# Altium schematic sheet manip-cam-mod-schematic.SchDoc: Manipulator & Camera Module
size A3; Author: Sander Furre; CompanyName: VORTEX NTNU; SheetNumber: 1; ProjectName: Manipulator-Camera-Module
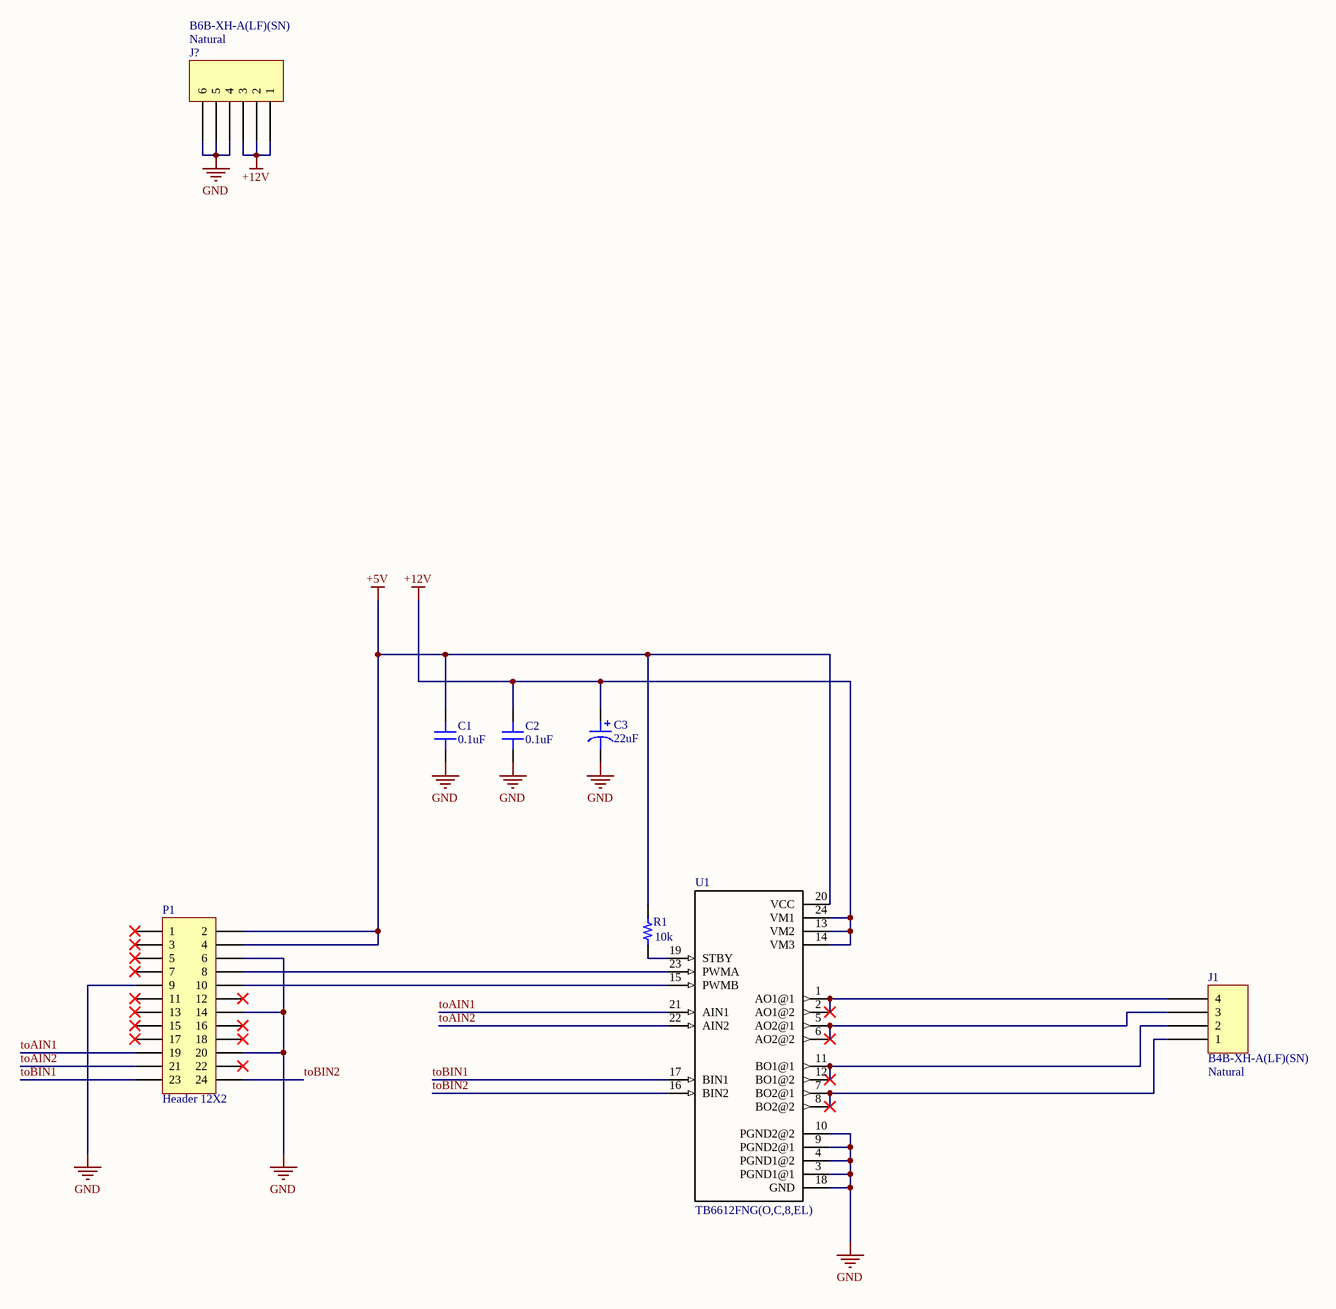
[diagram p0: manip-cam-mod-schematic.SchDoc]

## Parts
C1  0.1uF  [RES 0805/2012]
C2  0.1uF  [RES 0805/2012]
C3  22uF  [CAP ALUM 6.6MM]
J1  B4B-XH-A(LF)(SN)  Colour: Natural  [JST XH B4B-XH-A]
J?  B6B-XH-A(LF)(SN)  Colour: Natural  [JST XH B6B-XH-A]
P1  Header 12X2  [HDR2X12]
R1  10k  [RES 0805/2012]
U1  TB6612FNG(O,C,8,EL)  [SOP65P760X160-24N]

## Nets
+5V: C1.2 P1.2 P1.4 R1.2 U1.20(VCC)
+12V: C2.2 C3.1 J?.1 J?.2 J?.3 U1.13(VM2) U1.14(VM3) U1.24(VM1)
GND: C1.1 C2.1 C3.2 J?.4 J?.5 J?.6 P1.6 P1.9 P1.14 P1.20 U1.3(PGND1@1) U1.4(PGND1@2) U1.9(PGND2@1) U1.10(PGND2@2) U1.18(GND)
toAIN1: P1.19 U1.21(AIN1)
toAIN2: P1.21 U1.22(AIN2)
toBIN1: P1.23 U1.17(BIN1)
toBIN2: P1.24 U1.16(BIN2)
NetJ1_1: J1.1 U1.7(BO2@1) U1.8(BO2@2)
NetJ1_2: J1.2 U1.11(BO1@1) U1.12(BO1@2)
NetJ1_3: J1.3 U1.5(AO2@1) U1.6(AO2@2)
NetJ1_4: J1.4 U1.1(AO1@1) U1.2(AO1@2)
NetP1_8: P1.8 U1.23(PWMA)
NetP1_10: P1.10 U1.15(PWMB)
NetR1_1: R1.1 U1.19(STBY)

Not connected (* = marked no-connect by the designer): P1 1* 3* 5* 7* 11* 12* 13* 15* 16* 17* 18* 22*

## Notes on the sheet
- Title
- Size
- Author
- Rev
- A3
- Sheet no.
- of

## Library data of the parts
C1 C2 = C2012X7R1H104K085AA: CAP CER 0.1UF 50V X7R 0805; Manufacturer: TDK Corporation; TemperatureRange: -55C ~ 125C; Tolerance: 10%; Value: 0.1uF; Part Number: C2012X7R1H104K085AA; PartId: 4390; Supplier 1: Digi-Key; Supplier Part Number 1: 445-7534-2-ND; ComponentLink1Description: Datasheet; ComponentLink1URL: https://product.tdk.com/info/en/catalog/datasheets/mlcc_commercial_general_en.pdf; ComponentLink2Description: Digi-Key listing; ComponentLink2URL: http://digikey.com/product-detail/en/C2012X7R1H104K085AA/445-7534-2-ND/2732969; TemperatureCoefficient: X7R; Voltage: 50V; Price: 0,0182; Type: -; Device Package: 0805 (2012 Metric)
C3 = EEE-1EA220AP: CAP ALUM 22UF 20% 25V SMD; Manufacturer: Panasonic Electronic Components; TemperatureRange: -40C ~ 85C; Type: High Temperature Reflow; Ripple Current: 55mA; Lifetime @ Temp: 2000 Hrs @ 85C; Value: 22uF; Part Number: EEE-1EA220AP; PartId: 7220; Supplier 1: Digi-Key; Supplier Part Number 1: PCE4596TR-ND; ComponentLink1Description: Datasheet; ComponentLink1URL: http://media.digikey.com/pdf/Data%20Sheets/Panasonic%20Electronic%20Components/S_Series_Type_V.pdf; ComponentLink2Description: Digi-Key listing; ComponentLink2URL: http://digikey.com/product-detail/en/EEE-1EA220AP/PCE4596TR-ND/1717762; Tolerance: 20%; Voltage: 25V; Price: 0,1368; Device Package: Radial, Can - SMD; Impedance: -
J1 = B4B-XH-A(LF)(SN): CONN HEADER XH TOP 4POS 2.5MM; Manufacturer: JST Sales America Inc.; Pitch: 0.098" (2.50mm); Number Of Positions: 4; Part Number: B4B-XH-A(LF)(SN); PartId: 16451; Supplier 1: Digi-Key; Supplier Part Number 1: 455-2249-ND; ComponentLink1Description: Datasheet; ComponentLink1URL: http://www.jst-mfg.com/product/pdf/eng/eXH.pdf; ComponentLink2Description: Digi-Key Listing; ComponentLink2URL: http://www.digikey.com/product-detail/en/jst-sales-america-inc/B4B-XH-A(LF)(SN)/455-2249-ND/1651047; Price: 0,21; Type: Header, Shrouded; Contact Finish: Tin; Fastening Type: Detent Lock; Number Of Rows: 1; Series: XH
J? = B6B-XH-A(LF)(SN): CONN HEADER XH TOP 6POS 2.5MM; Manufacturer: JST Sales America Inc.; Pitch: 0.098" (2.50mm); Number Of Positions: 6; Part Number: B6B-XH-A(LF)(SN); PartId: 16453; Supplier 1: Digi-Key; Supplier Part Number 1: 455-2271-ND; ComponentLink1Description: Datasheet; ComponentLink1URL: http://www.jst-mfg.com/product/pdf/eng/eXH.pdf; ComponentLink2Description: Digi-Key Listing; ComponentLink2URL: http://www.digikey.com/product-detail/en/jst-sales-america-inc/B6B-XH-A(LF)(SN)/455-2271-ND/1000381; Price: 0,27; Type: Header, Shrouded; Contact Finish: Tin; Fastening Type: Detent Lock; Number Of Rows: 1; Series: XH
P1 = Header 12X2: Header, 12-Pin, Dual row; LatestRevisionDate: 17-Jul-2002; LatestRevisionNote: Re-released for DXP Platform.; Publisher: Altium Limited
R1 = ERA-6AEB103V: RES SMD 10K OHM 0.1% 1/8W 0805; Manufacturer: Panasonic Electronic Components; TemperatureRange: -55C ~ 155C; TemperatureCoefficient: 25ppm/C; PowerRating: 0.125W, 1/8W; Value: 10k; Part Number: ERA-6AEB103V; PartId: 2446; Supplier 1: Digi-Key; Supplier Part Number 1: P10KDATR-ND; ComponentLink1Description: Datasheet; ComponentLink1URL: http://industrial.panasonic.com/lecs/www-data/pdf/AOA0000/AOA0000CE26.pdf; ComponentLink2Description: Digi-Key listing; ComponentLink2URL: http://digikey.com/product-detail/en/ERA-6AEB103V/P10KDATR-ND/1465773; Tolerance: 0.1%; Price: 0,0653; Type: Thin Film; Device Package: 0805 (2012 Metric)
U1 = TB6612FNG(O,C,8,EL: Stepping Motor Driver Ic Unipolor Copper Wire 8; MF: Toshiba; MP: TB6612FNG(O,C,8,EL; Price: 2.11 USD; Package: SSOP-24 Toshiba; Availability: Good; Value: *; ComponentLink2URL: https://www.digikey.com/product-detail/en/toshiba-semiconductor-and-storage/TB6612FNGC8EL/TB6612FNGC8ELCT-ND/1730134